# EAGLE design clvHd_Master (EAGLE 9.6.2)
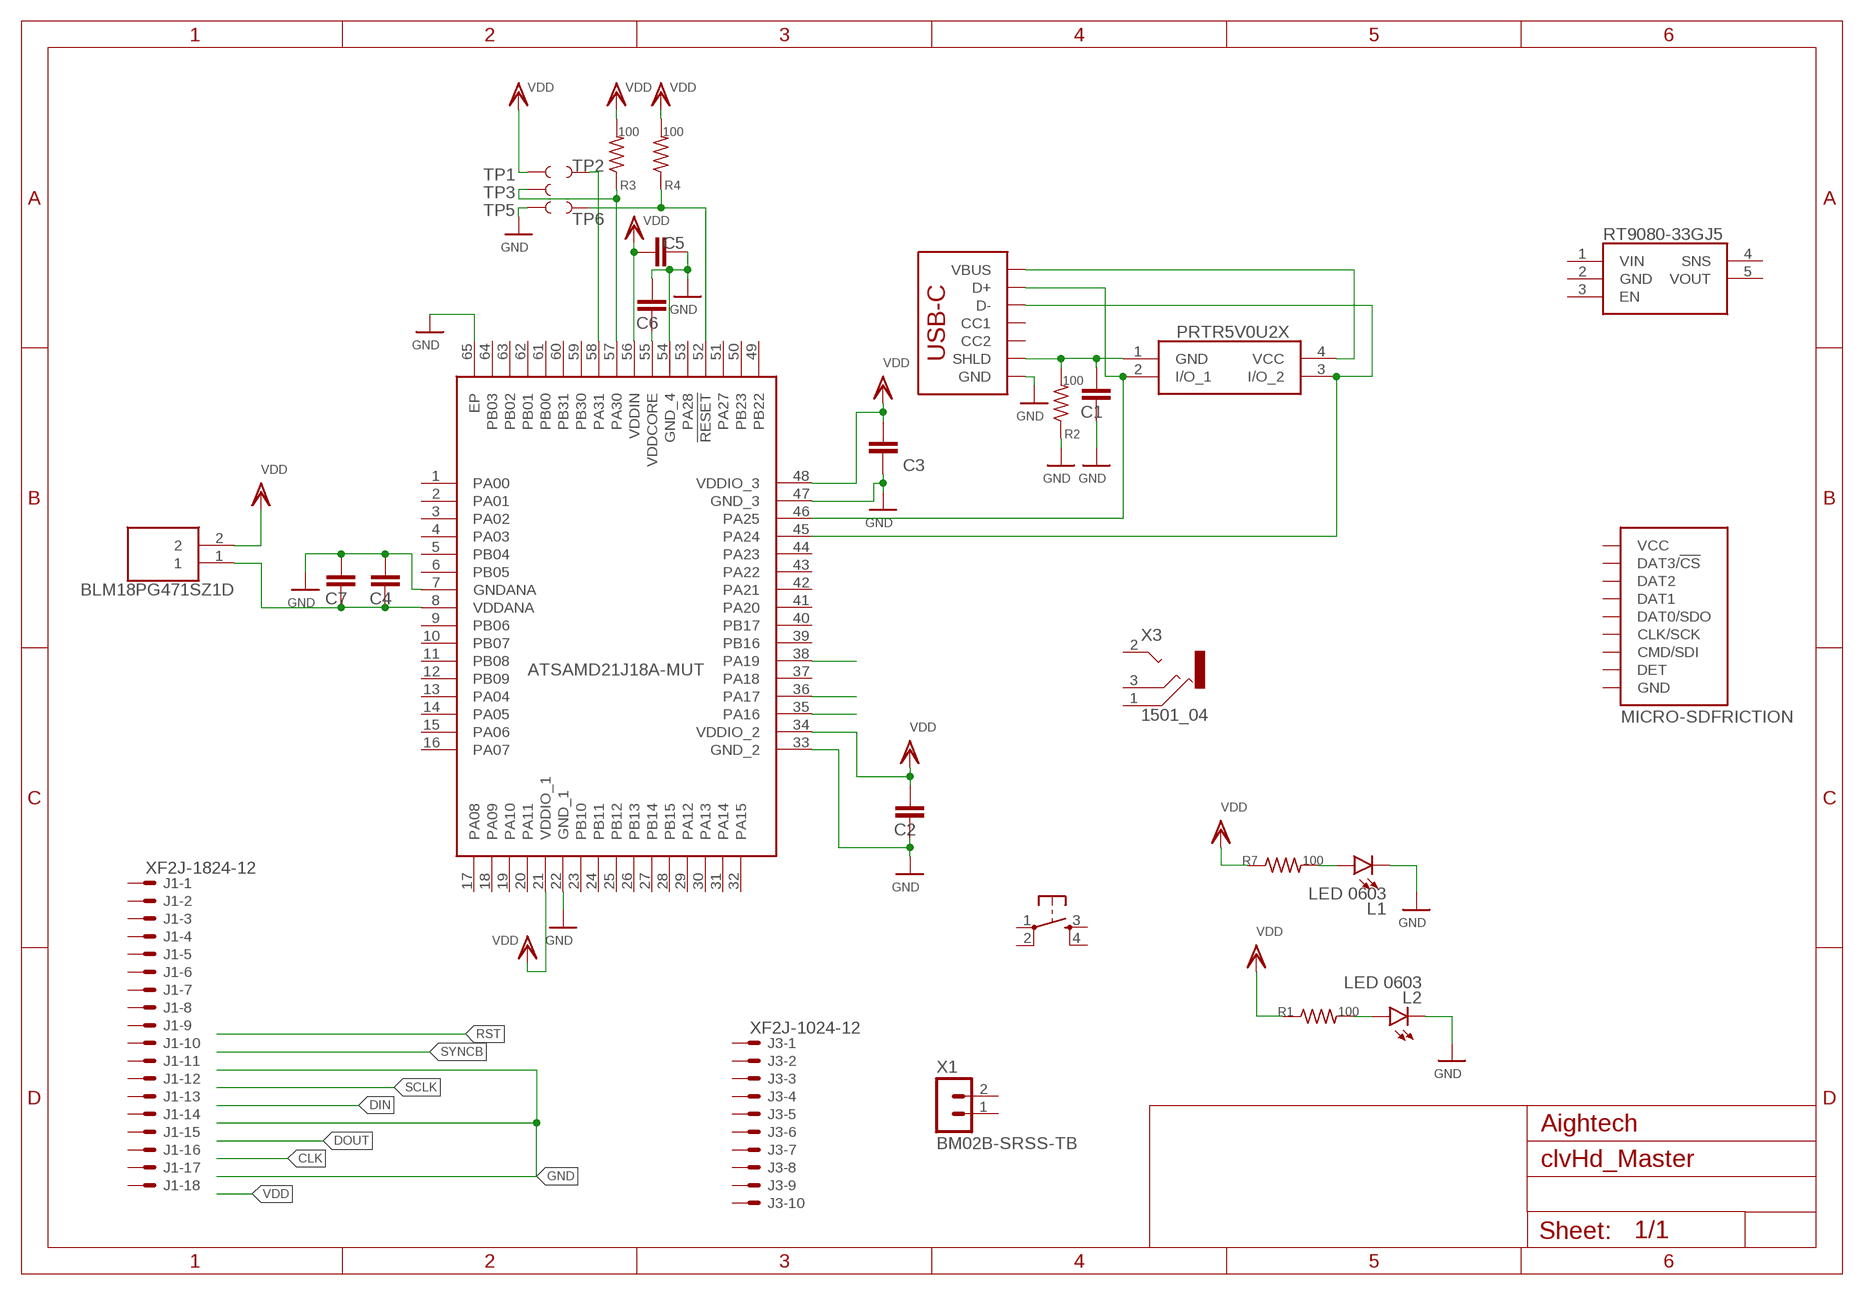
[diagram p0: schematic, sheet 1]

## Parts
C1  C-EUC0402  [C0402]
C2  C-EUC0402  [C0402]
C3  C-EUC0402  [C0402]
C4  C-EUC0402  [C0402]
C5  C-EUC0402  [C0402]
C6  C-EUC0402  [C0402]
C7  C-EUC0402  [C0402]
D1  PRTR5V0U2X  [PRTR5V0U2X]
FL1  BLM18PG471SZ1D  [BLM18AG102BH1D]
IC1  ATSAMD21J18A-MUT  [QFN50P900X900X100-65N]
IC2  RT9080-33GJ5  [SOT94P280X100-5N]
J1  XF2J-1824-12  [XF2J-1824-12]
J2  USB_C_2-LAYER_PADS  [USB-C-16P-2LAYER-PADS]
J3  XF2J-1024-12  [XF2J-1024-12]
J4  MICRO-SDFRICTION  [MICROSD_TINY]
L1  LED 0603  LEDCHIP-LED0603  [CHIP-LED0603]
L2  LED 0603  LEDCHIP-LED0603  [CHIP-LED0603]
R1  100  R-US_R0402  [R0402]
R2  100  R-US_R0402  [R0402]
R3  100  R-US_R0402  [R0402]
R4  100  R-US_R0402  [R0402]
R7  100  R-US_R0402  [R0402]
S2  TAC_SWITCHSMD  [TACTILE-SWITCH-SMD]
TP1  TEST-POINT3  [PAD.03X.03]
TP2  TEST-POINT3  [PAD.03X.03]
TP3  TEST-POINT3  [PAD.03X.03]
TP5  TEST-POINT3  [PAD.03X.03]
TP6  TEST-POINT3  [PAD.03X.03]
X1  BM02B-SRSS-TB  [BM02B-SRSS-TB]
X3  1501_04  [1501_05]

## Nets
GND: C1.2 C2.2 C3.2 C4.1 C5.1 C6.1 C7.1 IC1.7(GNDANA) IC1.22(GND_1) IC1.33(GND_2) IC1.47(GND_3) IC1.54(GND_4) IC1.65(EP) J2.GND J2.GND2(GND) L1.C L2.C R2.1 TP5.1
N$1: L2.A R1.2
N$2: L1.A R7.2
N$3: C1.1 D1.1(GND) J2.SHLD1(SHLD) J2.SHLD2(SHLD) J2.SHLD3(SHLD) J2.SHLD4(SHLD) R2.2
N$4: D1.4(VCC) J2.VBUS1(VBUS) J2.VBUS2(VBUS)
N$5: D1.2(I/O_1) IC1.46(PA25) J2.A6(D+) J2.B6(D+)
N$6: D1.3(I/O_2) IC1.45(PA24) J2.A7(D-) J2.B7(D-)
N$7: IC1.35(PA16)
N$8: C6.2 IC1.55(VDDCORE)
N$9: C4.2 C7.2 FL1.1 IC1.8(VDDANA)
N$10: IC1.36(PA17)
N$11: IC1.38(PA19)
N$12: IC1.52(!RESET) R4.1 TP6.1
N$13: IC1.58(PA31) TP2.1
N$15: IC1.57(PA30) R3.1 TP3.1
VDD: C2.1 C3.1 C5.2 FL1.2 IC1.21(VDDIO_1) IC1.34(VDDIO_2) IC1.48(VDDIO_3) IC1.56(VDDIN) R1.1 R3.2 R4.2 R7.1 TP1.1
Unconnected: IC1.1(PA00) IC1.2(PA01) IC1.3(PA02) IC1.4(PA03) IC1.5(PB04) IC1.6(PB05) IC1.9(PB06) IC1.10(PB07) IC1.11(PB08) IC1.12(PB09) IC1.13(PA04) IC1.14(PA05) IC1.15(PA06) IC1.16(PA07) IC1.17(PA08) IC1.18(PA09) IC1.19(PA10) IC1.20(PA11) IC1.23(PB10) IC1.24(PB11) IC1.25(PB12) IC1.26(PB13) IC1.27(PB14) IC1.28(PB15) IC1.29(PA12) IC1.30(PA13) IC1.31(PA14) IC1.32(PA15) IC1.37(PA18) IC1.39(PB16) IC1.40(PB17) IC1.41(PA20) IC1.42(PA21) IC1.43(PA22) IC1.44(PA23) IC1.49(PB22) IC1.50(PB23) IC1.51(PA27) IC1.53(PA28) IC1.59(PB30) IC1.60(PB31) IC1.61(PB00) IC1.62(PB01) IC1.63(PB02) IC1.64(PB03) IC2.1(VIN) IC2.2(GND) IC2.3(EN) IC2.4(SNS) IC2.5(VOUT) J1.1 J1.2 J1.3 J1.4 J1.5 J1.6 J1.7 J1.8 J1.9 J1.10 J1.11 J1.12 J1.13 J1.14 J1.15 J1.16 J1.17 J1.18 J2.A5(CC1) J2.B5(CC2) J3.1 J3.2 J3.3 J3.4 J3.5 J3.6 J3.7 J3.8 J3.9 J3.10 J4.1(DAT2) J4.2(DAT3/!CS!) J4.3(CMD/SDI) J4.4(VCC) J4.5(CLK/SCK) J4.6(GND) J4.7(DAT0/SDO) J4.8(DAT1) J4.9(DET) J4.GND1(GND) J4.GND2(GND) J4.GND3(GND) J4.GND4(GND) J4.GND5(GND) J4.GND6(GND) S2.1 S2.2 S2.3 S2.4 X1.1 X1.2 X3.1 X3.2 X3.3

## Notes on the sheet
- Aightech

## Library data of the parts
C1-C7 = rclCustom:C-EU: CAPACITOR, European symbol; SPICEPREFIX: C
D1 = SamacSys_Parts:PRTR5V0U2X: NEXPERIA - PRTR5V0U2X - DIODE, TVS, DUAL, SOT-143B Source: Datasheet <https://assets.nexperia.com/documents/data-sheet/PRTR5V0U2X.pdf>; DESCRIPTION: NEXPERIA - PRTR5V0U2X - DIODE, TVS, DUAL, SOT-143B; HEIGHT: 1.1mm; MANUFACTURER_NAME: Nexperia; MANUFACTURER_PART_NUMBER: PRTR5V0U2X
FL1 = SamacSys_Parts:BLM18PG471SZ1D: BLM18_Z1D Series EMI Suppression Filter 470+/-25% at 100MHz 1A @85 Source: Datasheet <https://www.murata.com/en-us/products/productdetail?partno=BLM18PG471SZ1#>; DESCRIPTION: BLM18_Z1D Series EMI Suppression Filter 470+/-25% at 100MHz 1A @85; HEIGHT: 0.95mm; MANUFACTURER_NAME: Murata Electronics; MANUFACTURER_PART_NUMBER: BLM18PG471SZ1D
IC1 = SamacSys_Parts:ATSAMD21J18A-MUT: ARM Microcontrollers - MCU 256KB 32KB 64QFN GRN1.6-3.6V48MHz Source: Datasheet <https://datasheet.datasheetarchive.com/originals/distributors/DKDS41/DSANUWW0026743.pdf>; DESCRIPTION: ARM Microcontrollers - MCU 256KB 32KB 64QFN GRN1.6-3.6V48MHz; HEIGHT: 1mm; MANUFACTURER_NAME: Microchip; MANUFACTURER_PART_NUMBER: ATSAMD21J18A-MUT
IC2 = SamacSys_Parts:RT9080-33GJ5: IC REG LIN 3.3V 600MA TSOT23-5 Source: Datasheet <https://www.richtek.com/assets/product_file/RT9080/DS9080-05.pdf>; DESCRIPTION: IC REG LIN 3.3V 600MA TSOT23-5; HEIGHT: 1mm; MANUFACTURER_NAME: RICHTEK; MANUFACTURER_PART_NUMBER: RT9080-33GJ5
J1 = con-omron:XF2*-18?: OMRON FPC Connector Source : http://www.omron.com/ecb/products/pdf/fpc.pdf; OC_FARNELL: unknown; OC_NEWARK: unknown
J2 = SparkFun-Connectors:USB_C: USB Type C 16Pin Connector Super Speed pins not available on the 16-pin purely SMD connector so this part is best for USB 2.0 implementations. D1 and D2 are tied together enabling D+/- no matter which way the cable is plugged into the connector. The two channel configuration pins (CC1/2) are exposed. These are normally connected to ground via 5.1k resistors but can be reconfigured for high current/high power applications. **4-LAYER BOARD WARNING!!** If designing 4-layer board, make sure to select the variant _4-LAYER-ISOLATED. The linked footprint (USB-C-16-4LAYER-ISOLATED) includes some very necessary cutout polygons in the inner layers (2 and 15). This prevents the PTH mounting shield legs on the USB connector from electrically connecting any other polygons on the inner layers (usually VCC and GND).; PROD_ID: CONN-14122
J3 = con-omron:XF2*-10?: OMRON FPC Connector Source : http://www.omron.com/ecb/products/pdf/fpc.pdf; OC_FARNELL: unknown; OC_NEWARK: unknown
J4 = SparkFun-Connectors:MICRO-SD: microSD Socket for Transflash Various sockets for µSD. tDoc lines correctly indicate media card edge positions when inserting (unlocked, locked, depressed). NOTE: CD1 and CD2 are connected internally, and the default detect state of the socket is detect pin to ground. SparkFun Products: WAV Trigger <https://www.sparkfun.com/products/13660> CAN-Bus Shield <https://www.sparkfun.com/products/13262> SparkFun Level Shifing microSD Breakout <https://www.sparkfun.com/products/13743>; PROD_ID: CONN-13500
L1 L2 = led:LED: LED OSRAM: - CHIPLED LG R971, LG N971, LY N971, LG Q971, LY Q971, LO R971, LY R971 LH N974, LH R974 LS Q976, LO Q976, LY Q976 LO Q996 - Hyper CHIPLED LW Q18S LB Q993, LB Q99A, LB R99A - SideLED LS A670, LO A670, LY A670, LG A670, LP A670 LB A673, LV A673, LT A673, LW A673 LH A674 LY A675 LS A676, LA A676, LO A676, LY A676, LW A676 LS A679, LY A679, LG A679 - Hyper Micro SIDELED® LS Y876, LA Y876, LO Y876, LY Y876 LT Y87S - SmartLED LW L88C, LW L88S LB L89C, LB L89S, LG L890 LS L89K, LO L89K, LY L89K LS L896, LA L896, LO L896, LY L896 - TOPLED LS T670, LO T670, LY T670, LG T670, LP T670 LSG T670, LSP T670, LSY T670, LOP T670, LYG T670 LG T671, LOG T671, LSG T671 LB T673, LV T673, LT T673, LW T673 LH T674 LS T676, LA T676, LO T676, LY T676, LB T676, LH T676, LSB T676, LW T676 LB T67C, LV T67C, LT T67C, LS T67K, LO T67K, LY T67K, LW E67C LS E67B, LA E67B, LO E67B, LY E67B, LB E67C, LV E67C, LT E67C LW T67C LS T679, LY T679, LG T679 LS T770, LO T770, LY T770, LG T770, LP T770 LB T773, LV T773, LT T773, LW T773 LH T774 LS E675, LA E675, LY E675, LS T675 LS T776, LA T776, LO T776, LY T776, LB T776 LHGB T686 LT T68C, LB T68C - Hyper Mini TOPLED® LB M676 - Mini TOPLED Santana® LG M470 LS M47K, LO M47K, LY M47K Source: http://www.osram.convergy.de LUXEON: - LUMILED® LXK2-PW12-R00, LXK2-PW12-S00, LXK2-PW14-U00, LXK2-PW14-V00 LXK2-PM12-R00, LXK2-PM12-S00, LXK2-PM14-U00 LXK2-PE12-Q00, LXK2-PE12-R00, LXK2-PE12-S00, LXK2-PE14-T00, LXK2-PE14-U00 LXK2-PB12-K00, LXK2-PB12-L00, LXK2-PB12-M00, LXK2-PB14-N00, LXK2-PB14-P00, LXK2-PB14-Q00 LXK2-PR12-L00, LXK2-PR12-M00, LXK2-PR14-Q00, LXK2-PR14-R00 LXK2-PD12-Q00, LXK2-PD12-R00, LXK2-PD12-S00 LXK2-PH12-R00, LXK2-PH12-S00 LXK2-PL12-P00, LXK2-PL12-Q00, LXK2-PL12-R00 Source: www.luxeon.com KINGBRIGHT: KA-3528ASYC Source: www.kingbright.com
R1-R4 R7 = rcl:R-US_: RESISTOR, American symbol; SPICEPREFIX: R
S2 = SparkFun-Retired:TAC_SWITCH: Momentary Switch Button commonly used for reset or general input. Spark Fun Electronics SKU : COM-00097 SMT- SWCH-08247; PROD_ID: SWCH-08247
TP1-TP3 TP5 TP6 = SparkFun-Connectors:TEST-POINT: SparkFun Test Points Bare copper test points for troubleshooting or In-Circuit-Testing. These are used by our Production team for verifying production board runs using pogo-pins on test beds. SparkFun Products: SparkFun LSM9DS1 Breakout <https://www.sparkfun.com/products/13284> SparkFun PSOC <https://www.sparkfun.com/products/13714> SparkFun Load Cell Amplifier <https://www.sparkfun.com/products/13879>
X1 = con-JST SH:BM02B-SRSS: JST SH series header 1.00mm pitch disconnectable crimp style connectors, vertical (side entry type), 2 pins
X3 = con-lumberg:1501_0*: Jack connectors according to JISC 6560, 2.5 mm Klinkensteckverbinder nach JISC 6560, 2,5 mm Source: http://www.lumberg.com/Produkte/PDFs/1501_05.pdfedit 1501_03 http://www.lumberg.com/Produkte/PDFs/1501_06.pdf; OC_FARNELL: 1216977; OC_NEWARK: unknown

## Board
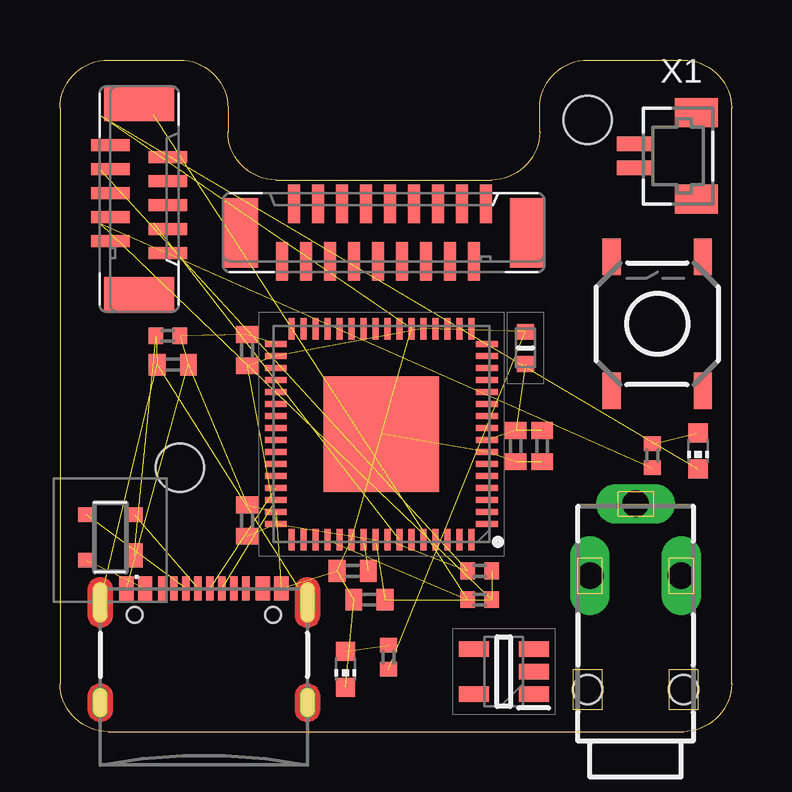
[diagram p1: board, top side]
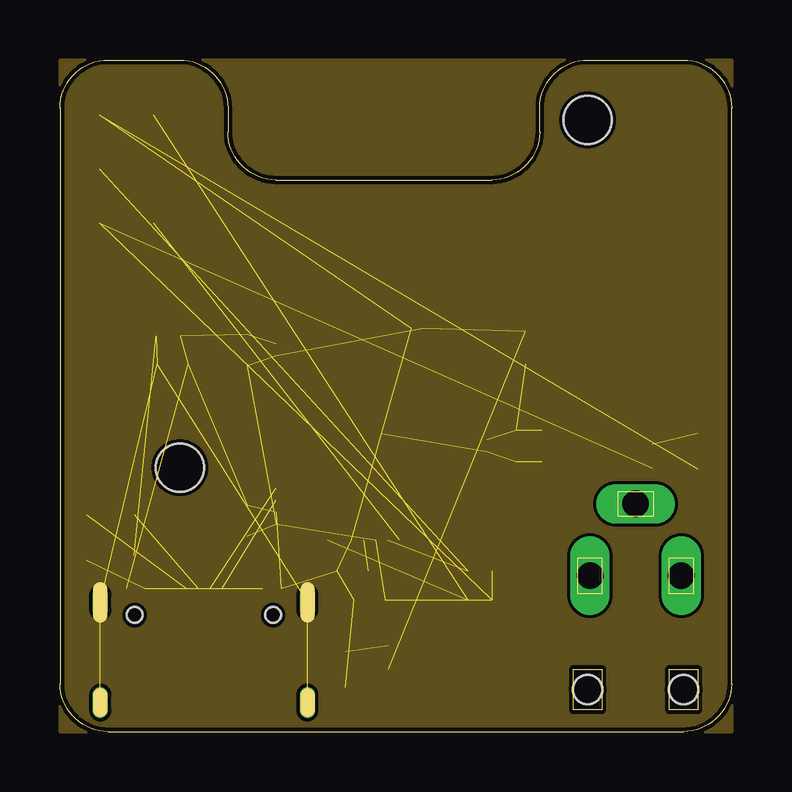
[diagram p2: board, inner layer Route2]
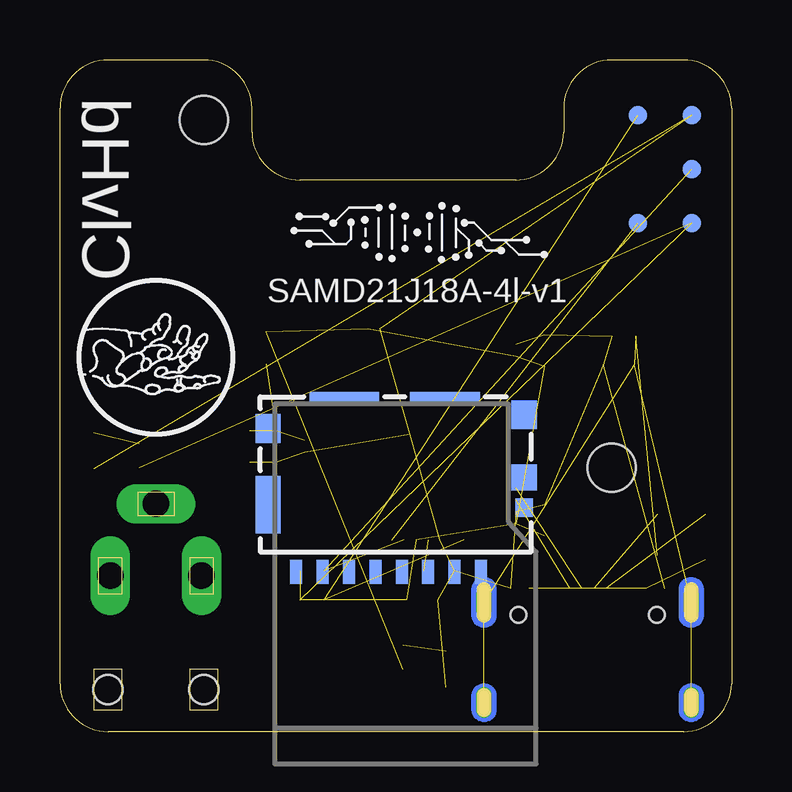
[diagram p3: board, bottom side, seen from below]

Size 28 x 28 mm. Coordinates in mm from the lower left corner, seen from the top.
Outline: 0,26 0,2 arc90 2,0 26,0 arc90 28,2 28,26 arc90 26,28 22,28 arc90 20,26 20,25 arc-90 18,23 9,23 arc-90 7,25 7,26 arc90 5,28 2,28 arc90 0,26
Copper layers (1*2*15*16): Top 0.035559375mm / dielectric 0.47751875mm / Route2 0.035559375mm / dielectric 0.47751875mm / Route15 0.035559375mm / dielectric 0.47751875mm / Bottom 0.035559375mm
Design rules "SparkFun-4-Layer-Minimum-JLCPCB": minimum track width 5mil, minimum drill 0.2mm, track to track 5mil, track to pad 5mil, pad to pad 5mil, via to via 5mil, smd to smd 5mil, copper to edge 7mil, drill to drill 7mil, minimum pad ring 5mil, minimum via ring 5mil, stop-mask expansion 2.5mil, vias tented up to drill 25mil, thermal gap 10mil
Holes 2 mm at 5,11 22,25.5

### Footprints (pad centres in the part's own frame; a part is rotated, then mirrored left to right if it is on the bottom)
C0402 = smd 0.7 x 0.9: 1 -0.65,0; 2 0.65,0
PRTR5V0U2X = smd 1 x 0.7: 1 -0.75,-1 | smd 0.6 x 0.7: 2 0.95,-1; 3 0.95,1; 4 -0.95,1
BLM18AG102BH1D = smd 0.65 x 0.7: 1 -0.675,0; 2 0.675,0
QFN50P900X900X100-65N = smd 0.9 x 0.25: 1 -4.4,3.75; 2 -4.4,3.25; 3 -4.4,2.75; 4 -4.4,2.25; 5 -4.4,1.75; 6 -4.4,1.25; 7 -4.4,0.75; 8 -4.4,0.25; 9 -4.4,-0.25; 10 -4.4,-0.75; 11 -4.4,-1.25; 12 -4.4,-1.75; 13 -4.4,-2.25; 14 -4.4,-2.75; 15 -4.4,-3.25; 16 -4.4,-3.75; 33 4.4,-3.75; 34 4.4,-3.25; 35 4.4,-2.75; 36 4.4,-2.25; 37 4.4,-1.75; 38 4.4,-1.25; 39 4.4,-0.75; 40 4.4,-0.25; 41 4.4,0.25; 42 4.4,0.75; 43 4.4,1.25; 44 4.4,1.75; 45 4.4,2.25; 46 4.4,2.75; 47 4.4,3.25; 48 4.4,3.75 | smd 0.25 x 0.9: 17 -3.75,-4.4; 18 -3.25,-4.4; 19 -2.75,-4.4; 20 -2.25,-4.4; 21 -1.75,-4.4; 22 -1.25,-4.4; 23 -0.75,-4.4; 24 -0.25,-4.4; 25 0.25,-4.4; 26 0.75,-4.4; 27 1.25,-4.4; 28 1.75,-4.4; 29 2.25,-4.4; 30 2.75,-4.4; 31 3.25,-4.4; 32 3.75,-4.4; 49 3.75,4.4; 50 3.25,4.4; 51 2.75,4.4; 52 2.25,4.4; 53 1.75,4.4; 54 1.25,4.4; 55 0.75,4.4; 56 0.25,4.4; 57 -0.25,4.4; 58 -0.75,4.4; 59 -1.25,4.4; 60 -1.75,4.4; 61 -2.25,4.4; 62 -2.75,4.4; 63 -3.25,4.4; 64 -3.75,4.4 | smd 4.8 x 4.8: 65 0,0
SOT94P280X100-5N = smd 1.25 x 0.65: 1 -1.25,0.94; 2 -1.25,0; 3 -1.25,-0.94; 4 1.25,-0.94; 5 1.25,0.94
XF2J-1824-12 = smd 1.6 x 0.5: 1 -1.2,4.25; 2 1.2,3.75; 3 -1.2,3.25; 4 1.2,2.75; 5 -1.2,2.25; 6 1.2,1.75; 7 -1.2,1.25; 8 1.2,0.75; 9 -1.2,0.25; 10 1.2,-0.25; 11 -1.2,-0.75; 12 1.2,-1.25; 13 -1.2,-1.75; 14 1.2,-2.25; 15 -1.2,-2.75; 16 1.2,-3.25; 17 -1.2,-3.75; 18 1.2,-4.25 | smd 2.9 x 1.4: M1 0,5.95; M2 0,-5.95
USB-C-16P-2LAYER-PADS = smd 0.3 x 1: A5 -1.25,-0.34; A6 -0.25,-0.34; A7 0.25,-0.34; A8 1.25,-0.34; B5 1.75,-0.34; B6 0.75,-0.34; B7 -0.75,-0.34; B8 -1.75,-0.34 | smd 0.6 x 1: GND -3.225,-0.34; GND2 3.225,-0.34; VBUS1 -2.45,-0.34; VBUS2 2.45,-0.34 | drill 0.4 pad 0.6 long: SHLD1 -4.318,-0.915; SHLD2 4.318,-0.915; SHLD3 -4.318,-5.095; SHLD4 4.318,-5.095 | hole 0.65: -2.89,-1.445; 2.89,-1.445
XF2J-1024-12 = smd 1.6 x 0.5: 1 -1.2,2.25; 2 1.2,1.75; 3 -1.2,1.25; 4 1.2,0.75; 5 -1.2,0.25; 6 1.2,-0.25; 7 -1.2,-0.75; 8 1.2,-1.25; 9 -1.2,-1.75; 10 1.2,-2.25 | smd 2.9 x 1.4: M1 0,3.95; M2 0,-3.95
MICROSD_TINY = smd 0.5 x 1: 1 3.55,-3.85; 2 2.45,-3.85; 3 1.35,-3.85; 4 0.25,-3.85; 5 -0.85,-3.85; 6 -1.95,-3.85; 7 -3.05,-3.85; 8 -4.15,-3.85 | smd 0.72 x 0.78: 9 5.35,-1.17 | smd 1.05 x 1.08: GND1 5.35,0.1 | smd 1.05 x 1.2: GND2 5.35,2.71; GND3 -5.325,2.14 | smd 1.05 x 2.39: GND4 -5.325,-1.045 | smd 2.91 x 0.55: GND5 -2.145,3.385; GND6 2.045,3.385
CHIP-LED0603 = smd 0.8 x 0.8: A 0,-0.75; C 0,0.75
R0402 = smd 0.6 x 0.7: 1 -0.5,0; 2 0.5,0
TACTILE-SWITCH-SMD = smd 1.524 x 0.762: 1 -2.794,1.905; 2 2.794,1.905; 3 -2.794,-1.905; 4 2.794,-1.905
PAD.03X.03 = smd 0.762 x 0.762: 1 0,0
BM02B-SRSS-TB = smd 0.6 x 1.55: 1 0.5,0; 2 -0.5,0 | smd 1.2 x 1.8: M1 1.8,-2.525; M2 -1.8,-2.525
1501_05 = drill 1.1 pad 1.4 long: 1 -1.9,-8.5; 2 0,-11.5; 3 1.9,-8.5 | hole 1.2: -2,-3.75; 2,-3.75

### Placement (x,y rotation side)
C1  4.7,15.3 0 top
C2  7.8,15.9 90 top
C3  7.8,8.8 90 top
C4  19,11.9 90 top
C5  12.9,5.5 0 top
C6  12.2,6.7 0 top
C7  20.1,11.9 90 top
D1  2.1,8.1 90 top
FL1  19.4,16 90 top
IC1  13.4,12.4 180 top
IC2  18.5,2.5 180 top
J1  13.5,20.8 270 top
J2  6,6.3 0 top
J3  3.3,22.2 180 top
J4  14,10.5 0 bottom
L1  26.6,11.7 180 top
L2  11.9,2.6 180 top
R1  13.7,3.1 90 top
R2  4.5,16.5 180 top
R3  17.5,6.7 0 top
R4  17.5,5.5 0 top
R7  24.7,11.5 90 top
S2  24.9,17 90 top
TP1  1.65,21.2 180 bottom
TP2  3.9,21.2 180 bottom
TP3  1.65,23.45 180 bottom
TP5  1.65,25.7 180 bottom
TP6  3.9,25.7 180 bottom
X1  24,24 90 top
X3  24,-2 180 top

### Tracks (layer width: path | path; a pad name or v marks a point on that pad's centre or on a via)
GND  (18 unrouted)
  pour Route2: 0,28 28,28 28,0 0,0
N$1  (1 unrouted)
N$2  (1 unrouted)
N$3  (6 unrouted)
N$4  (2 unrouted)
N$5  (3 unrouted)
N$6  (3 unrouted)
N$8  (1 unrouted)
N$9  (3 unrouted)
N$12  (2 unrouted)
N$13  (1 unrouted)
N$15  (2 unrouted)
VDD  (12 unrouted)

### Text on the board
bNames: Designed by Aightech | ClvHd | SAMD21J18A-4l-v1